# EAGLE schematic toy_redesign2 (EAGLE 7.4.0)
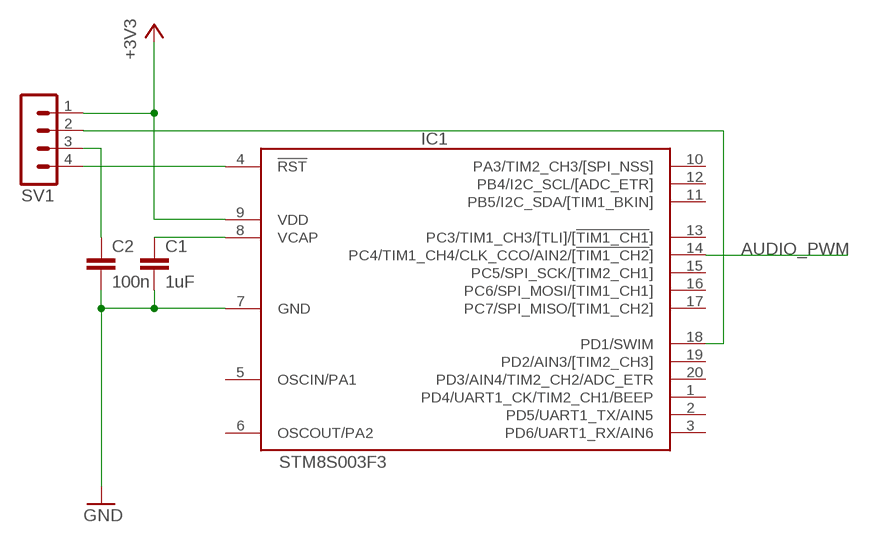
[diagram p0: schematic, sheet 1]

## Parts
C1  1uF  C-EUC0805  [C0805]
C2  100n  C-EUC0805  [C0805]
IC1  STM8S003F3  [TSSOP20]
SV1  MA04-1  [MA04-1]

## Nets
+3V3: IC1.9(VDD) SV1.1
AUDIO_PWM: IC1.14(PC4/TIM1_CH4/CLK_CCO/AIN2/[!TIM1_CH2!])
GND: C1.2 C2.2 IC1.7(GND)
N$1: IC1.4(!RST) SV1.4
N$2: C1.1 IC1.8(VCAP)
N$3: C2.1 SV1.3
N$4: IC1.18(PD1/SWIM) SV1.2
Unconnected: IC1.1(PD4/UART1_CK/TIM2_CH1/BEEP) IC1.2(PD5/UART1_TX/AIN5) IC1.3(PD6/UART1_RX/AIN6) IC1.5(OSCIN/PA1) IC1.6(OSCOUT/PA2) IC1.10(PA3/TIM2_CH3/[SPI_NSS]) IC1.11(PB5/I2C_SDA/[TIM1_BKIN]) IC1.12(PB4/I2C_SCL/[ADC_ETR]) IC1.13(PC3/TIM1_CH3/[TLI]/[!TIM1_CH1!]) IC1.15(PC5/SPI_SCK/[TIM2_CH1]) IC1.16(PC6/SPI_MOSI/[TIM1_CH1]) IC1.17(PC7/SPI_MISO/[TIM1_CH2]) IC1.19(PD2/AIN3/[TIM2_CH3]) IC1.20(PD3/AIN4/TIM2_CH2/ADC_ETR)

## Library data of the parts
C1 C2 = rcl:C-EU: CAPACITOR, European symbol
IC1 = stm8:STM8S003: Value line, 16 MHz STM8S 8-bit MCU, 8 Kbytes Flash, 128 bytes data EEPROM, 10-bit ADC, 3 timers, UART, SPI, I2C
SV1 = con-lstb:MA04-1: PIN HEADER; OC_FARNELL: unknown; OC_NEWARK: unknown